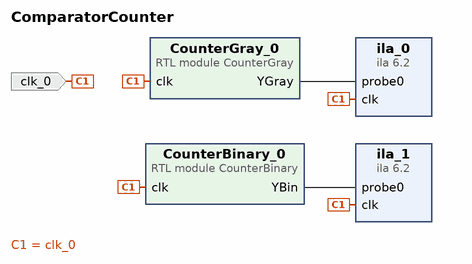
[diagram p0: block diagram of the top level]
# Vivado block design ComparatorCounter, xc7a35ticsg324-1L, Vivado 2019.2
create_bd_design ComparatorCounter

create_bd_port -dir I -type clk clk_0

create_bd_cell -type ip -vlnv xilinx.com:ip:ila:6.2 ila_0
set_property -dict [list \
  CONFIG.ALL_PROBE_SAME_MU_CNT 2 \
  CONFIG.C_ADV_TRIGGER true \
  CONFIG.C_ENABLE_ILA_AXI_MON false \
  CONFIG.C_EN_STRG_QUAL 1 \
  CONFIG.C_MONITOR_TYPE Native \
  CONFIG.C_NUM_OF_PROBES 1 \
  CONFIG.C_PROBE0_MU_CNT 2 \
  CONFIG.C_PROBE0_WIDTH 4 \
  CONFIG.C_PROBE1_MU_CNT 2 \
  CONFIG.C_PROBE1_WIDTH 1 \
] [get_bd_cells ila_0]
create_bd_cell -type module -reference CounterGray CounterGray_0
create_bd_cell -type module -reference CounterBinary CounterBinary_0
create_bd_cell -type ip -vlnv xilinx.com:ip:ila:6.2 ila_1
set_property -dict [list \
  CONFIG.C_ENABLE_ILA_AXI_MON false \
  CONFIG.C_MONITOR_TYPE Native \
  CONFIG.C_NUM_OF_PROBES 1 \
  CONFIG.C_PROBE0_WIDTH 4 \
] [get_bd_cells ila_1]

# ---- connections ----

connect_bd_net -net clk_0_1 [get_bd_ports clk_0] \
  [get_bd_pins ila_0/clk] [get_bd_pins CounterGray_0/clk] [get_bd_pins CounterBinary_0/clk] [get_bd_pins ila_1/clk]
connect_bd_net [get_bd_pins CounterGray_0/YGray] [get_bd_pins ila_0/probe0]
connect_bd_net [get_bd_pins CounterBinary_0/YBin] [get_bd_pins ila_1/probe0]

validate_bd_design
save_bd_design
